# Altium schematic sheet TinyPICO.SchDoc: TinyPICO
size 287 x 217 mm; Date: 22-04-2019; Origin: Eagle; REV: V1 P3; GateName_1: G$1; SymbolName_1: FRAME_A4_TINYPICO; LibraryName: UnexpectedMaker; DeviceSetName: FRAME_A4_TINYPICO; CDATE: 24/04/2019; SHEET_NUM: 1/1; Sheet: Sheet:; UnexpectedMaker: Unexpected Maker; /Users/seon/Dropbox/UnexpectedMaker/Branding/UM_Logo_White.bmp: /Users/seon/Dropbox/Unexpected Maker/Branding/UM_Logo_White.bmp; /Users/seon/Dropbox/UnexpectedMaker/Branding/UM_Logo_White2.bmp: /Users/seon/Dropbox/Unexpected Maker/Branding/UM_Logo_White2.bmp; unexpectedmaker.com: unexpectedmaker.com
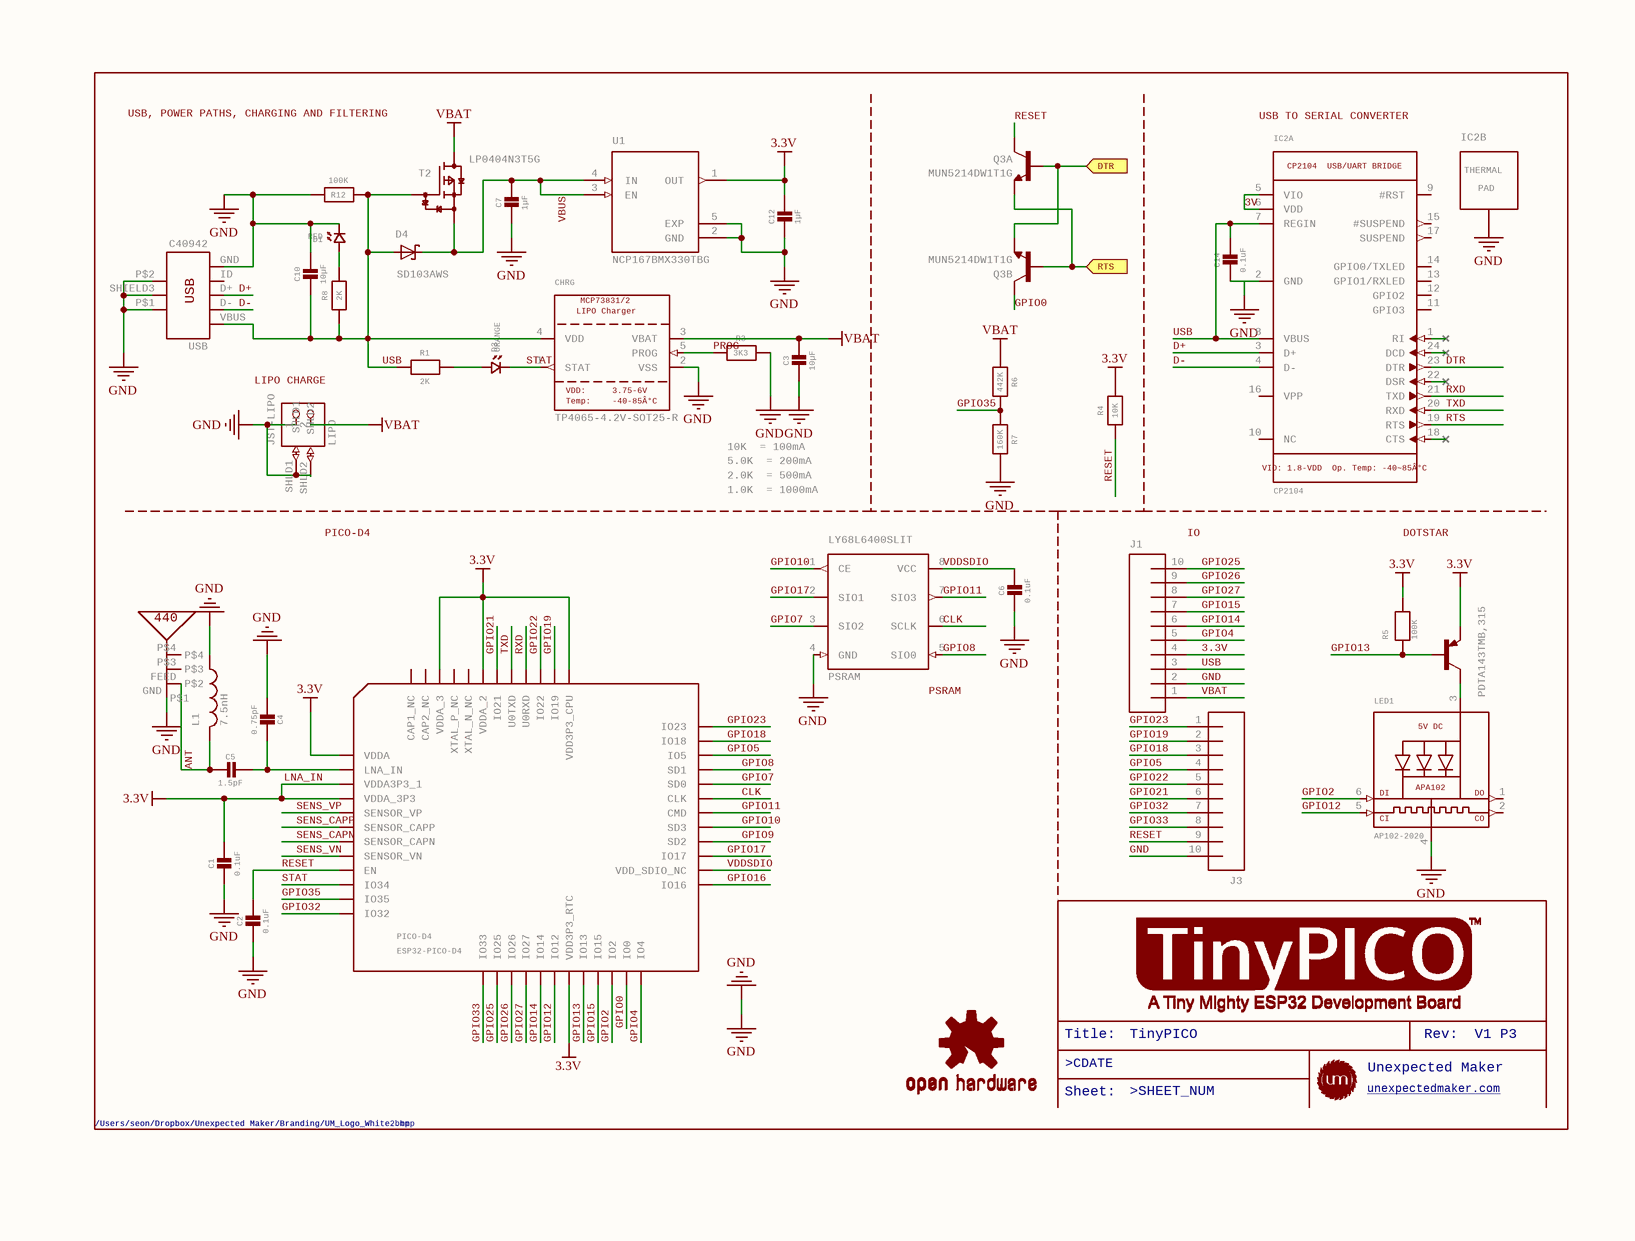
[diagram p0: TinyPICO.SchDoc]

## Parts
C1  0.1uF  [_0402MP]
C2  0.1uF  [_0402MP]
C3  10µF  [_0603MP]
C4  0.75pF  [_0402MP]
C5  1.5pF  [_0402MP]
C6  0.1uF  [_0402MP]
C7  1µF  [_0402MP]
C10  10µF  [_0603MP]
C12  1µF  [_0402MP]
C14  0.1uF  [_0402MP]
CHRG  TP4065-4.2V-SOT25-R  LIPOCharger: LIPO Charger  Temp: Temp:  VDD: VDD:  [SOT23-5]
D1  RED  [0402.LED]
D3  ORANGE  [0402.LED]
D4  BAT60J  [SOD323_ST]  (value not drawn)
IC2  CP2104  CP2104
USB/UARTBRIDGE: CP2104 / USB/UART BRIDGE  VIO:1.8-VDD
Op.Temp:-40~85Â°C: VIO: 1.8-VDD / Op. Temp: -40~85Â°C  [MICROBUILDER_QFN24_4MM_SMSC]  (parts A,B of 2)
J1  TINYPICO_HEADER_10NO_SILK_PTH_FEMALE  [1X10_NO_SILK]  (value not drawn)
J3  TINYPICO_HEADER_10NO_SILK_PTH_FEMALE  [1X10_NO_SILK]  (value not drawn)
JST-LIPO  LIPO  [JSTPH2]
L1  7.5nH  [RESC0402_N]
LED1  AP102-2020  5VDC: 5V DC  [MICROBUILDER_APA102_2020]
LOGO1  OSHW-LOGOS  [OSHW-LOGO-S]  (value not drawn)
LY68L6400SLIT  PSRAM  [SOP8]
PDTA143TMB,315  TINYPICO-PNPAMB  [SOT883(B)]  (value not drawn)
PICO-D4  ESP32-PICO-D4  [PICO-D4-QFN48]
Q3  MUN5214DW1T1G  [DUAL_NPN_SC70-6]  (parts A,B of 2)
R1  2K  [_0402MP]
R3  3K3  [_0402MP]
R4  10K  [_0402MP]
R5  100K  [_0402MP]
R6  442K  [_0402MP]
R7  160K  [_0402MP]
R8  2K  [_0402MP]
R12  100K  [_0402MP]
T2  TINYPICO-P-FETMB  [SOT883(B)]  (value not drawn)
U1  NCP170AMX300TCG  [VREG_NCP170AMX300TCG]  (value not drawn)
U$8  PRO-OB-440  [PRO-OB-440]  (value not drawn)
U$26  NOCONNECTION  (value not drawn)
U$27  NOCONNECTION  (value not drawn)
U$28  NOCONNECTION  (value not drawn)
U$31  NOCONNECTION  (value not drawn)
USB  C40942  [USB-B-MICRO-SMD]

## Ports
DTR (in), RTS (in)

## Nets
3.3V: C1.1 C12.1 J1.4 PDTA143TMB,315.2(E) PICO-D4.1(VDDA) PICO-D4.3(VDDA3P3_1) PICO-D4.4(VDDA_3P3) PICO-D4.19(VDD3P3_RTC) PICO-D4.37(VDD3P3_CPU) PICO-D4.43(VDDA_2) PICO-D4.46(VDDA_3) R4.2 R5.2 U1.1(OUT)
GND: C1.2 C2.2 C3.2 C4.2 C6.2 C7.2 C10.1 C12.2 C14.2 CHRG.2(VSS) D1.P$2 IC2.2(GND) IC2.THERM(TP) J1.2 J3.10 JST-LIPO.1 JST-LIPO.SHLD1 JST-LIPO.SHLD2 L1.1 LED1.4(GND) LY68L6400SLIT.4(GND) R3.2 R7.2 R12.2 U1.2(GND) U1.5(EXP) U$8.GND(P$1) USB.GND USB.P$1(SHIELD1) USB.P$2(SHIELD2) USB.SHIELD3(SHIELD)
VBAT: C3.1 CHRG.3(VBAT) J1.1 JST-LIPO.2 R6.1 T2.3(D)
3V: IC2.5(VIO) IC2.6(VDD)
ANT: C5.2 L1.2 U$8.FEED(P$2)
CLK: LY68L6400SLIT.6(SCLK) PICO-D4.31(CLK)
D+: IC2.3(D+) USB.D+
D-: IC2.4(D-) USB.D-
DTR: IC2.23(DTR)
DTR: Q3.1(E) Q3.5(B) ; port DTR  [a separate net that carries the same name]
GPIO0: PICO-D4.23(IO0) Q3.6(C)
GPIO2: LED1.6(DI) PICO-D4.22(IO2)
GPIO4: J1.5 PICO-D4.24(IO4)
GPIO5: J3.4 PICO-D4.34(IO5)
GPIO7: LY68L6400SLIT.3(SIO2) PICO-D4.32(SD0)
GPIO8: LY68L6400SLIT.5(SIO0) PICO-D4.33(SD1)
GPIO9: PICO-D4.28(SD2)
GPIO10: LY68L6400SLIT.1(CE) PICO-D4.29(SD3)
GPIO11: LY68L6400SLIT.7(SIO3) PICO-D4.30(CMD)
GPIO12: LED1.5(CKI) PICO-D4.18(IO12)
GPIO13: PDTA143TMB,315.1(B) PICO-D4.20(IO13) R5.1
GPIO14: J1.6 PICO-D4.17(IO14)
GPIO15: J1.7 PICO-D4.21(IO15)
GPIO16: PICO-D4.25(IO16)
GPIO17: LY68L6400SLIT.2(SIO1) PICO-D4.27(IO17)
GPIO18: J3.3 PICO-D4.35(IO18)
GPIO19: J3.2 PICO-D4.38(IO19)
GPIO21: J3.6 PICO-D4.42(IO21)
GPIO22: J3.5 PICO-D4.39(IO22)
GPIO23: J3.1 PICO-D4.36(IO23)
GPIO25: J1.10 PICO-D4.14(IO25)
GPIO26: J1.9 PICO-D4.15(IO26)
GPIO27: J1.8 PICO-D4.16(IO27)
GPIO32: J3.7 PICO-D4.12(IO32)
GPIO33: J3.8 PICO-D4.13(IO33)
GPIO35: PICO-D4.11(IO35) R6.2 R7.1
LNA_IN: C4.1 C5.1 PICO-D4.2(LNA_IN)
PROG: CHRG.5(PROG) R3.1
RESET: C2.1 J3.9 PICO-D4.9(EN) Q3.3(C) R4.1
RTS: IC2.19(RTS)
RTS: Q3.2(B) Q3.4(E) ; port RTS  [a separate net that carries the same name]
RXD: IC2.21(TXD) PICO-D4.40(U0RXD)
SENS_CAPN: PICO-D4.7(SENSOR_CAPN)
SENS_CAPP: PICO-D4.6(SENSOR_CAPP)
SENS_VN: PICO-D4.8(SENSOR_VN)
SENS_VP: PICO-D4.5(SENSOR_VP)
STAT: CHRG.1(STAT) D3.P$2 PICO-D4.10(IO34)
TXD: IC2.20(RXD) PICO-D4.41(U0TXD)
USB: C10.2 C14.1 CHRG.4(VDD) D4.A IC2.7(REGIN) IC2.8(VBUS) J1.3 R1.1 R8.1 R12.1 T2.1(G) USB.VBUS
VBUS: C7.1 D4.C T2.2(S) U1.3(EN) U1.4(IN)
VDDSDIO: C6.1 LY68L6400SLIT.8(VCC) PICO-D4.26(VDD_SDIO_NC)
NetD1_P$1: D1.P$1 R8.2
NetD3_P$1: D3.P$1 R1.2
NetLED1_3: LED1.3(VDD) PDTA143TMB,315.3(C)

Not connected (* = marked no-connect by the designer): IC2 1(RI) 9(#RST) 10(NC) 11(GPIO3) 12(GPIO2) 13(GPIO1/RXLED) 14(GPIO0/TXLED) 15(#SUSPEND) 16(VPP) 17(SUSPEND) 18(CTS) 22(DSR) 24(DCD); LED1 1(DO) 2(CKO); PICO-D4 44(XTAL_N_NC) 45(XTAL_P_NC) 47(CAP2_NC) 48(CAP1_NC); U$8 P$3 P$4; USB ID

## Notes on the sheet
- USB, POWER PATHS, CHARGING AND FILTERING
- (near T2) LP0404N3T5G
- USB TO SERIAL CONVERTER
- (near D4) SD103AWS
- (near U1) NCP167BMX330TBG
- (near JST-LIPO) LIPO CHARGE
- 10K  = 100mA
- 5.0K  = 200mA
- PICO-D4
- 2.0K  = 500mA
- 1.0K  = 1000mA
- (near J1) IO
- DOTSTAR
- (near LY68L6400SLIT) PSRAM
- Title:
- TinyPICO
- Rev:
- V1 P3
- Sheet:
- >CDATE
- >SHEET_NUM
- unexpectedmaker.com <http://unexpectedmaker.com>
- Unexpected Maker
- /Users/seon/Dropbox/Unexpected Maker/Branding/UM_Logo_White.bmp
- /Users/seon/Dropbox/Unexpected Maker/Branding/UM_Logo_White2.bmp

## Library data of the parts
C1 C2 C4-C7 C12 C14 = CAP_CERAMIC_0402MP: Ceramic Capacitors   For new designs, use the packages preceded by an '_' character since they are more reliable:   The following footprints should be used on most boards: _0402 - Standard footprint for regular board layouts  _0603 - Standard footprint for regular board layouts  _0805 - Standard footprint for regular board layouts  _1206 - Standard footprint for regular board layouts       For extremely tight-pitch boards where space is at a premium, the following 'micro-pitch' footprints can be used (smaller pads, no silkscreen outline, etc.): _0402MP - Micro-pitch footprint for very dense/compact boards  _0603MP - Micro-pitch footprint for very dense/compact boards  _0805MP - Micro-pitch footprint for very dense/compact boards  _1206MP - Micro-pitch footprint for very dense/compact boards; GateName_1: G$1; SymbolName_1: CAPACITOR; DeviceName: _0402MP; LibraryName: microbuilder; DeviceSetName: CAP_CERAMIC
C3 C10 = CAP_CERAMIC_0603MP: Ceramic Capacitors   For new designs, use the packages preceded by an '_' character since they are more reliable:   The following footprints should be used on most boards: _0402 - Standard footprint for regular board layouts  _0603 - Standard footprint for regular board layouts  _0805 - Standard footprint for regular board layouts  _1206 - Standard footprint for regular board layouts       For extremely tight-pitch boards where space is at a premium, the following 'micro-pitch' footprints can be used (smaller pads, no silkscreen outline, etc.): _0402MP - Micro-pitch footprint for very dense/compact boards  _0603MP - Micro-pitch footprint for very dense/compact boards  _0805MP - Micro-pitch footprint for very dense/compact boards  _1206MP - Micro-pitch footprint for very dense/compact boards; GateName_1: G$1; SymbolName_1: CAPACITOR; DeviceName: _0603MP; LibraryName: microbuilder; DeviceSetName: CAP_CERAMIC
CHRG = MCP73831/2: MCP73831/2 LIPO Charger    VDD: 3.75 - 6V  Temp -40 - 85Â°C  Programmable Charge Rate: 15-500mA       NOTE: STAT is a tri-state logic output on the MCP73831 and an open-drain output on the MCP73832.   SOT23-5 with 4.2V output and tri-state logic on STAT = MCP73831T-2ACI/OT; GateName_1: G$1; SymbolName_1: MCP73831/2; LibraryName: microbuilder; DeviceSetName: MCP73831/2; MCP73831/2: MCP73831/2; -40-85Â°C: -40-85Â°C; 3.75-6V: 3.75-6V
D1 D3 = LED.0402: GateName_1: G$1; SymbolName_1: LED; DeviceName: .0402; LibraryName: cmonr_standardparts; DeviceSetName: LED
D4 = BAT60J: Schottky barrier diode   Source: www.st.com, BAT60J.pdf; GateName_1: G$1; SymbolName_1: SCHOTTKY; LibraryName: diode; DeviceSetName: BAT60J
IC2 = MICROBUILDER_CP2104: CP2104 - USB to UART Bridge    VDD Output: 3.45V; GateName_1: G$1; GateName_2: G$2; SymbolName_2: MICROBUILDER_THERMAL-SLUG; SymbolName_1: MICROBUILDER_CP2104; LibraryName: CP2104; DeviceSetName: MICROBUILDER_CP2104
J1 J3 = TINYPICO_HEADER_10NO_SILK_PTH_FEMALE: Multi connection point. Often used as Generic Header-pin footprint for 0.1 inch spaced/style header connections    On any of the 0.1 inch spaced packages, you can populate with these:  Break Away Headers - Straight (PRT-00116)   Break Away Male Headers - Right Angle (PRT-00553)   Female Headers (PRT-00115)   Break Away Headers - Machine Pin (PRT-00117)   Break Away Female Headers - Swiss Machine Pin (PRT-00743)   Arduino Stackable Header - 10 Pin (PRT-11376)        For SCREWTERMINALS and SPRING TERMINALS visit here:  Screw Terimnals on SparkFun.com (5mm/3.5mm/2.54mm spacing)       This device is also useful as a general connection point to wire up your design to another part of your project. Our various solder wires solder well into these plated through hole pads.  Hook-Up Wire - Assortment (Stranded, 22 AWG) (PRT-11375)   Hook-Up Wire - Assortment (Solid Core, 22 AWG) (PRT-11367)   View the entire wire category on our website here          Special notes:     Molex polarized connector foot print use with SKU : PRT-08231 with associated crimp pins and housings. 1MM SMD Version SKU: PRT-10208    NOTES ON THE VARIANTS LOCK and LOCK_LONGPADS... This footprint was designed to help hold the alignment of a through-hole component (i.e.  6-pin header) while soldering it into place. You may notice that each hole has been shifted either up or down by 0.005 of an inch from it's more standard position (which is a perfectly straight line).  This slight alteration caused the pins (the squares in the middle) to touch the edges of the holes.  Because they are alternating, it causes a "brace" to hold the component in place.  0.005 has proven to be the perfect amount of "off-center" position when using our standard breakaway headers. Although looks a little odd when you look at the bare footprint, once you have a header in there, the alteration is very hard to notice.  Also,if you push a header all the way into place, it is covered up entirely on the bottom side.; GateName_1: G$1; SymbolName_1: CONN_10; PROD_ID: CONN-11563; DeviceName: NO_SILK_PTH_FEMALE; LibraryName: UnexpectedMaker; DeviceSetName: TINYPICO_HEADER_10
JST-LIPO = JST_2PIN: JST 2-Pin Right-Angle Connector  PH-Series - 4UConnector: 17311  SH-Series - 4UConnector: 07278; GateName_1: G$1; SymbolName_1: PINHD2; LibraryName: UnexpectedMaker; DeviceSetName: JST_2PIN
L1 = INDUCTOR_0402_N: Generic chip inductor; GateName_1: L$1; SymbolName_1: L-US; DeviceName: _0402_N; LibraryName: Nordic_nRF; DeviceSetName: INDUCTOR
LED1 = MICROBUILDER_APA1022020: APA102/DotStar Pixels    VCC: 5V DC  Refresh Rate: 400Hz; GateName_1: G$1; DeviceName: 2020; SymbolName_1: MICROBUILDER_APA102; LibraryName: UnexpectedMaker; DeviceSetName: MICROBUILDER_APA102; APA102: APA102; DI: DI; DO: DO; CI: CI; CO: CO
LOGO1 = OSHW-LOGOS: Open-Source Hardware (OSHW) Logo     This logo indicates the piece of hardware it is found on incorporates a OSHW license and/or adheres to the definition of open source hardware found here: http://freedomdefined.org/OSHW; GateName_1: G$1; DeviceName: S; SymbolName_1: OSHW-LOGO; LibraryName: SparkFun-Aesthetics; DeviceSetName: OSHW-LOGO
LY68L6400SLIT = PSRAM: H-bridge driver for brush motors   Source: http://www.rohm.com/products/databook/motor/pdf/bd623x_series-e.pdf; MPN: BD6230F-E2; GateName_1: P; SymbolName_1: LY68L6400SLIT; LibraryName: UnexpectedMaker; DeviceSetName: PSRAM; MF: MF; OC_FARNELL: 1716264; OC_NEWARK: 15R0529
PDTA143TMB,315 = TINYPICO-PNPMB: PNP general purpose transistors   AAL Eindhoven MK; GateName_1: G$1; DeviceName: MB; SymbolName_1: PNP; LibraryName: UnexpectedMaker; DeviceSetName: TINYPICO-PNP
PICO-D4 = ESP32-PICO-D4: GateName_1: G$1; SymbolName_1: CY8C29666; LibraryName: UnexpectedMaker; DeviceSetName: ESP32-PICO-D4
Q3 = MBT3904DW1T1: MBT3904DW1 Dual NPN Transistors    The MBT3904W1 puts two general purpose 3904 NPN transistors in a single package.   Datasheet; GateName_1: Q1; SymbolName_1: ESP32-THING-TEMP_NPN; GateName_2: Q2; PROD_ID: TRANS-13337; SymbolName_2: ESP32-THING-TEMP_NPN; LibraryName: UnexpectedMaker; DeviceSetName: MBT3904DW1T1
R1 R3-R8 R12 = RESISTOR_0402MP: Resistors0402 - 0402 Surface Mount Package  22 Ohm 1% 1/16W [Digikey: 311-22.0LRTR-ND]  33 Ohm 5% 1/16W  1.0K 5% 1/16W  1.5K 5% 1/16W  2.0K 1% 1/16W  10.0K 1% 1/16W [Digikey: 311-10.0KLRTR-ND]  10.0K 5% 1/16W [Digikey: RMCF0402JT10K0TR-ND]  12.1K 1% 1/16W [Digikey: 311-22.0LRTR-ND]  100.0K 5% 1/16W    0603 - 0603 Surface Mount Package  0 Ohm 1/10 Watt 1% Resistor  15 Ohm 1/10 Watt 1% Resistor  33 Ohm 1/10 Watt 1% Resistor  49.9 Ohm 1/10 Watt 1% Resistor  100 Ohm 1/10 Watt 1% Resistor  150 Ohm 1/10 Watt 1% Resistor  240 Ohm 1/10 Watt 1% Resistor  390 Ohm 1/10 Watt 1% Resistor  560 Ohm 1/10 Watt 1% Resistor  680 Ohm 1/10 Watt 1% Resistor  750 Ohm 1/10 Watt 1% Resistor  1.0K Ohm 1/10 Watt 1% Resistor  1.5K Ohm 1/10 Watt 1% Resistor  2.0K Ohm 1/10 Watt 1% Resistor  2.2K Ohm 1/10 Watt 1% Resistor  3.3K Ohm 1/10 Watt 1% Resistor  4.7K Ohm 1/10 Watt 1% Resistor  10.0K Ohm 1/10 Watt 1% Resistor  12.0K Ohm 1/10 Watt 1% Resistor  12.1K Ohm 1/10 Watt 1% Resistor  20.0K Ohm 1/10 Watt 1% Resistor  33.0K Ohm 1/10 Watt 1% Resistor  100.0K Ohm 1/10 Watt 1% Resistor    0805 - 0805 Surface Mount Package  0 Ohm 1/8 Watt 1% Resistor  33 Ohm 1/8 Watt 1% Resistor  100 Ohm 1/8 Watt 1% Resistor  150 Ohm 1/8 Watt 1% Resistor  200 Ohm 1/8 Watt 1% Resistor  240 Ohm 1/8 Watt 1% Resistor  330 Ohm 1/8 Watt 1% Resistor  390 Ohm 1/8 Watt 1% Resistor  470 Ohm 1/8 Watt 1% Resistor  1.0K Ohm 1/8 Watt 1% Resistor  1.5K Ohm 1/8 Watt 1% Resistor  2.0K Ohm 1/8 Watt 1% Resistor  4.7K Ohm 1/8 Watt 1% Resistor  5.1K Ohm 1/8 Watt 1% Resistor  5.6K Ohm 1/8 Watt 1% Resistor  10.0K Ohm 1/8 Watt 1% Resistor  22.0K Ohm 1/8 Watt 1% Resistor  33.0K Ohm 1/8 Watt 1% Resistor  100K Ohm 1/8 Watt 1% Resistor    1206 - 1206 Surface Mount Package  2012 - 2010 Surface Mount Package  0.11 Ohm 1/2 Watt 1% Resistor - Digikey: RHM.11UCT-ND; GateName_1: G$1; SymbolName_1: RESISTOR; DeviceName: _0402MP; LibraryName: microbuilder; DeviceSetName: RESISTOR
T2 = TINYPICO-P-FETMB: 50 V, 150 mA P-channel Trench MOSFET P-channel enhancement mode Field-Effect Transistor (FET) in a small Surface-Mounted Device (SMD) plastic package using Trench MOSFET technology.    AAL Eindhoven MK; GateName_1: G$1; SymbolName_1: P-MOSFER-TR; DeviceName: MB; LibraryName: UnexpectedMaker; DeviceSetName: TINYPICO-P-FET
U1 = NCP170AMX300TCG: Fixed LDO Voltage Regulator, 2.2V to 5.5V, 190mV Dropout, 3Vout, 150mAout, XDFN-4; GateName_1: G$1; MF: ON Semiconductor; SymbolName_1: NCP170AMX300TCG; LibraryName: NCP170AMX300TCG; DeviceSetName: NCP170AMX300TCG; AVAILABILITY: Unavailable; MP: NCP170AMX300TCG; PACKAGE: XDFN-4 ON Semiconductor; PRICE: None
U$8 = PRO-OB-440: GateName_1: G$1; SymbolName_1: PRO-OB-440; LibraryName: UnexpectedMaker; DeviceSetName: PRO-OB-440; 440: 440
U$26-U$28 U$31 = NOCONNECTION: A No Connection symbol only   Handy to use on those pins that you want to mark as NC on a schematic.; GateName_1: G$1; SymbolName_1: NOCONNECTION; LibraryName: Philbywhizz; DeviceSetName: NOCONNECTION
USB = TINYPICO_USB_FEMALE-SMT: USB Type Micro-B Connector    Male/female and PTH/SMT variants   SparkFun Products:  SparkFun microB USB Breakout  SparkFun USB microB Plug Breakout  SparkFun ESP8266 Thing; GateName_1: G$1; SymbolName_1: USB-5PIN; PROD_ID: CONN-11752; DeviceName: _FEMALE-SMT; LibraryName: UnexpectedMaker; DeviceSetName: TINYPICO_USB; USB: USB